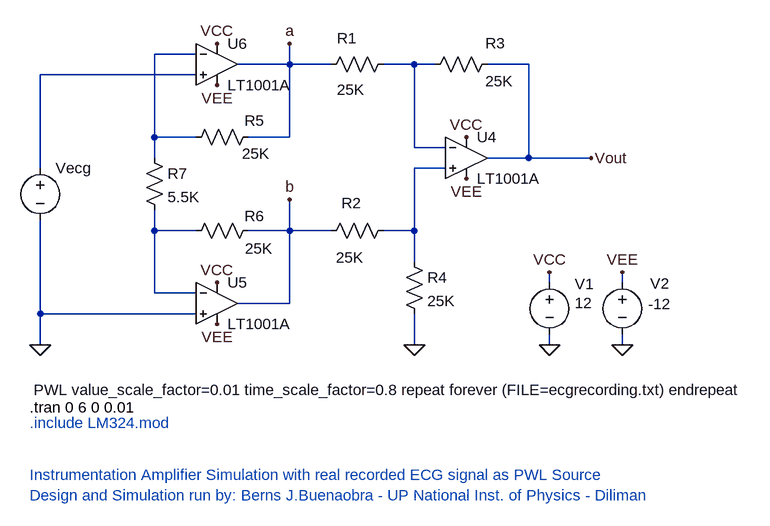
[diagram p0: schematic ECG signal processing via SPICE1.asc]
ECG signal processing via SPICE1.asc, the LTspice schematic file:
Version 4
SHEET 1 1896 960
WIRE -144 -992 -208 -992
WIRE 0 -976 0 -1008
WIRE 0 -976 -80 -976
WIRE 64 -976 0 -976
WIRE 192 -976 144 -976
WIRE 224 -976 192 -976
WIRE 368 -976 304 -976
WIRE -144 -960 -384 -960
WIRE -208 -864 -208 -992
WIRE -144 -864 -208 -864
WIRE 0 -864 0 -976
WIRE 0 -864 -64 -864
WIRE 192 -848 192 -976
WIRE 240 -848 192 -848
WIRE -208 -832 -208 -864
WIRE 368 -832 368 -976
WIRE 368 -832 304 -832
WIRE 464 -832 368 -832
WIRE -384 -816 -384 -960
WIRE 240 -816 192 -816
WIRE -208 -720 -208 -752
WIRE -144 -720 -208 -720
WIRE 0 -720 0 -768
WIRE 0 -720 -64 -720
WIRE 64 -720 0 -720
WIRE 192 -720 192 -816
WIRE 192 -720 144 -720
WIRE 192 -672 192 -720
WIRE 400 -640 400 -656
WIRE 512 -640 512 -656
WIRE -208 -624 -208 -720
WIRE -144 -624 -208 -624
WIRE 0 -608 0 -720
WIRE 0 -608 -80 -608
WIRE -384 -592 -384 -736
WIRE -144 -592 -384 -592
WIRE -384 -544 -384 -592
WIRE 192 -544 192 -592
WIRE 400 -544 400 -560
WIRE 512 -544 512 -560
FLAG -384 -544 0
FLAG 192 -544 0
FLAG 400 -656 VCC
FLAG 512 -656 VEE
FLAG 400 -544 0
FLAG 512 -544 0
FLAG 272 -864 VCC
FLAG -112 -640 VCC
FLAG 272 -800 VEE
FLAG -112 -1008 VCC
FLAG -112 -944 VEE
FLAG -112 -576 VEE
FLAG 464 -832 Vout
FLAG 0 -1008 a
FLAG 0 -768 b
SYMBOL voltage -384 -832 R0
WINDOW 123 0 0 Left 0
WINDOW 39 0 0 Left 0
WINDOW 3 -10 357 Left 0
SYMATTR Value PWL value_scale_factor=0.01 time_scale_factor=0.8 repeat forever (FILE=ecgrecording.txt) endrepeat
SYMATTR InstName Vecg
SYMBOL res 48 -960 R270
WINDOW 0 41 40 VTop 0
WINDOW 3 -7 46 VBottom 0
SYMATTR InstName R1
SYMATTR Value 25K
SYMBOL res 48 -704 R270
WINDOW 0 43 47 VTop 0
WINDOW 3 -10 45 VBottom 0
SYMATTR InstName R2
SYMATTR Value 25K
SYMBOL res 208 -960 R270
WINDOW 0 33 109 VTop 0
WINDOW 3 6 115 VBottom 0
SYMATTR InstName R3
SYMATTR Value 25K
SYMBOL res 176 -688 R0
SYMATTR InstName R4
SYMATTR Value 25K
SYMBOL res -160 -848 R270
WINDOW 0 26 106 VTop 0
WINDOW 3 6 108 VBottom 0
SYMATTR InstName R5
SYMATTR Value 25K
SYMBOL res -160 -704 R270
WINDOW 0 23 106 VTop 0
WINDOW 3 4 113 VBottom 0
SYMATTR InstName R6
SYMATTR Value 25K
SYMBOL res -224 -848 R0
SYMATTR InstName R7
SYMATTR Value 5.5K
SYMBOL voltage 400 -656 R0
WINDOW 0 39 18 Left 0
WINDOW 3 39 47 Left 0
WINDOW 123 0 0 Left 0
WINDOW 39 0 0 Left 0
SYMATTR InstName V1
SYMATTR Value 12
SYMBOL voltage 512 -656 R0
WINDOW 0 43 17 Left 0
WINDOW 3 40 49 Left 0
WINDOW 123 0 0 Left 0
WINDOW 39 0 0 Left 0
SYMATTR InstName V2
SYMATTR Value -12
SYMBOL Opamps\\LT1001A 272 -896 R0
SYMATTR InstName U4
SYMBOL Opamps\\LT1001A -112 -672 R0
SYMATTR InstName U5
SYMBOL Opamps\\LT1001A -112 -1040 R0
SYMATTR InstName U6
TEXT -400 -448 Left 0 !.tran 0 6 0 0.01
TEXT -400 -344 Left 0 ;Instrumentation Amplifier Simulation with real recorded ECG signal as PWL Source\nDesign and Simulation run by: Berns J.Buenaobra - UP National Inst. of Physics - Diliman
TEXT -400 -424 Left 0 ;.include LM324.mod

The netlist it stands for:
* ECG signal processing via SPICE1.asc
Vecg N003 0 PWL value_scale_factor=0.01 time_scale_factor=0.8 repeat forever (FILE=ecgrecording.txt) endrepeat
R1 a N002 25K
R2 b N004 25K
R3 N002 Vout 25K
R4 N004 0 25K
R5 N001 a 25K
R6 N005 b 25K
R7 N001 N005 5.5K
V1 VCC 0 12
V2 VEE 0 -12
XU4 N004 N002 VCC VEE Vout LT1001  ; LT1001A, pins In+ In- V+ V- OUT
XU5 0 N005 VCC VEE b LT1001  ; LT1001A, pins In+ In- V+ V- OUT
XU6 N003 N001 VCC VEE a LT1001  ; LT1001A, pins In+ In- V+ V- OUT
.tran 0 6 0 0.01
* Instrumentation Amplifier Simulation with real recorded ECG signal as PWL Source
* Design and Simulation run by: Berns J.Buenaobra - UP National Inst. of Physics - Diliman
* .include LM324.mod
.lib LTC.lib
.backanno
.end